# EAGLE design bdclock (EAGLE 7.5.0)
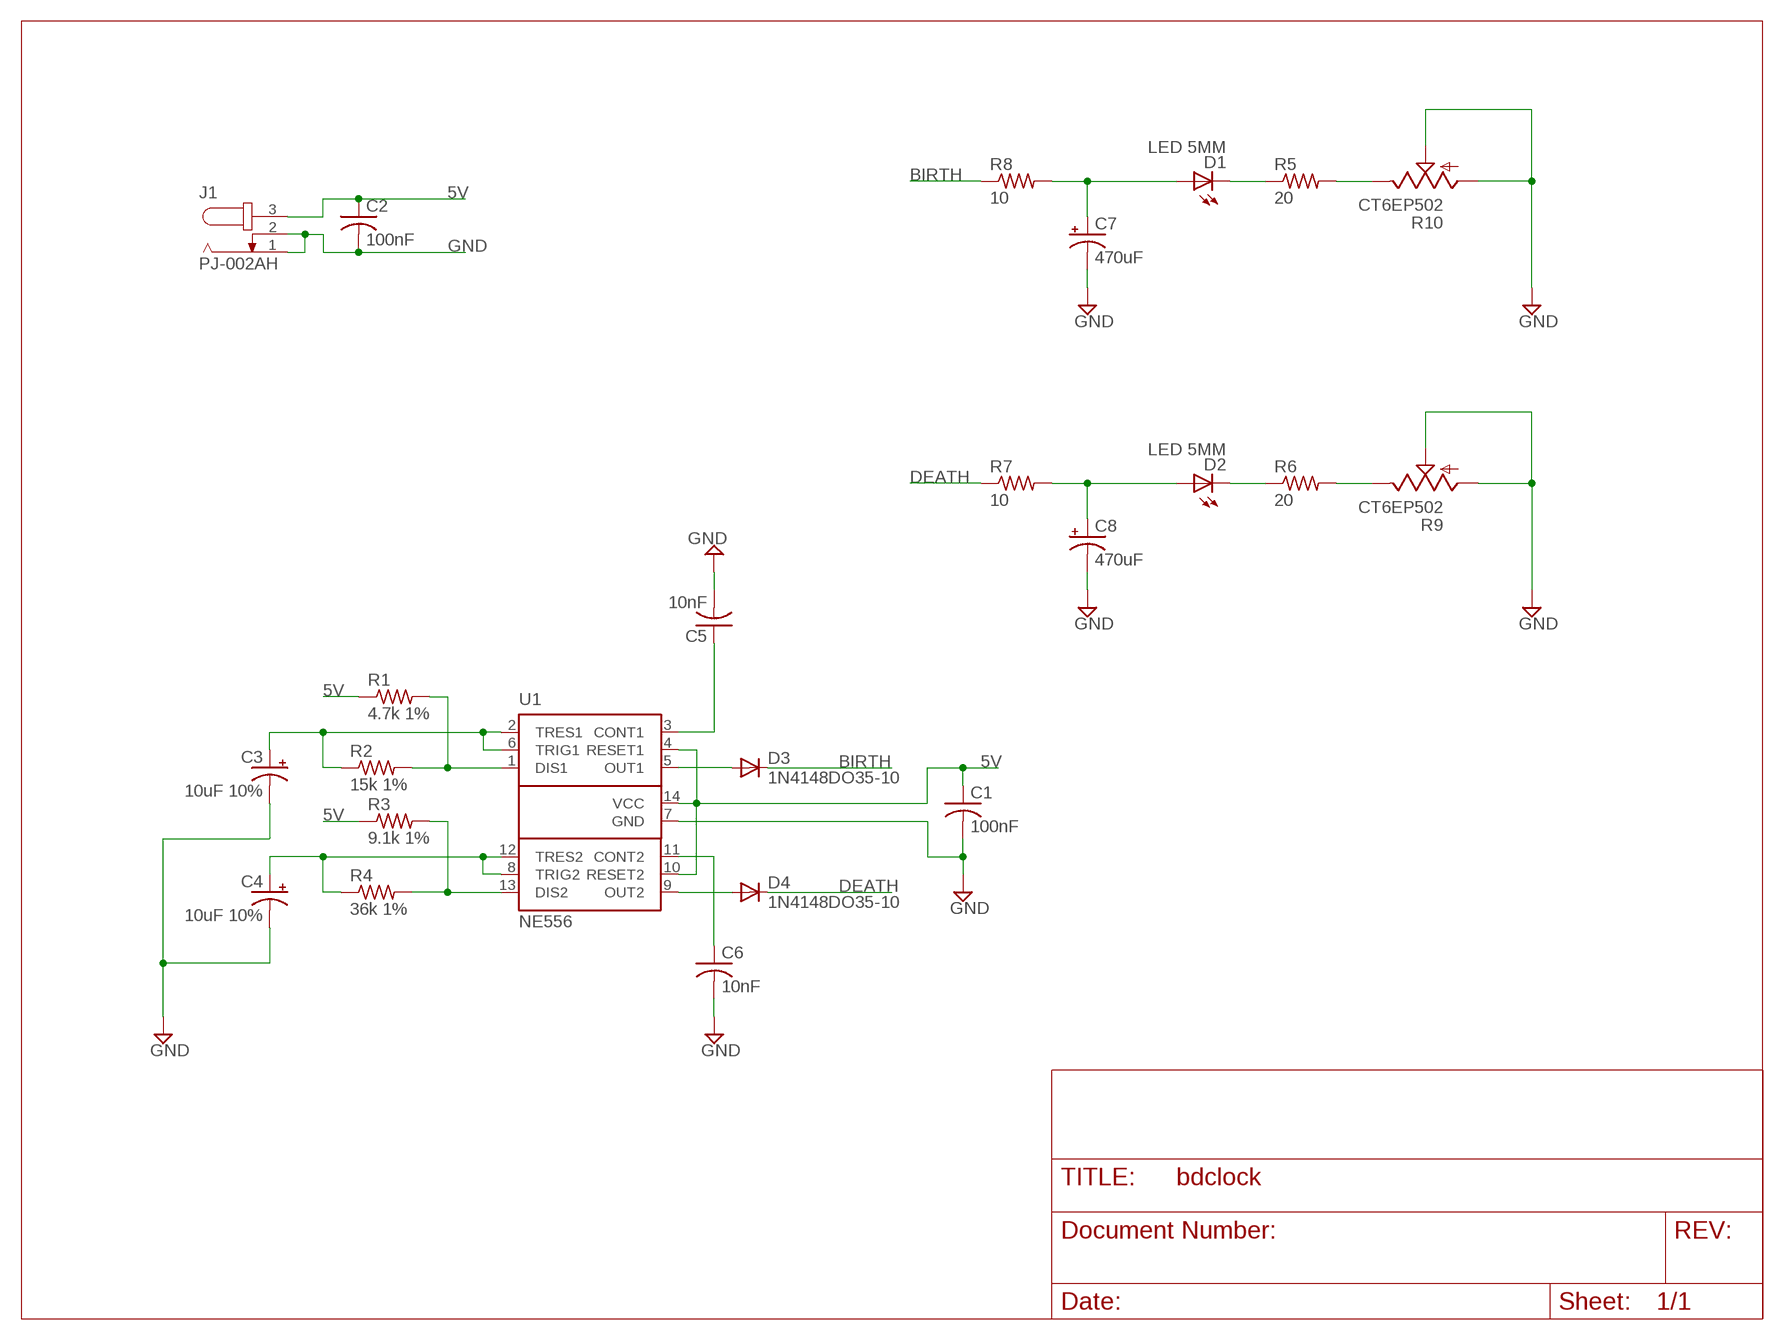
[diagram p0: schematic, sheet 1]

## Parts
C1  100nF  C-US025-025X050  [C025-025X050]
C2  100nF  C-US025-025X050  [C025-025X050]
C3  10uF 10%  CPOL-USE2-5  [E2-5]
C4  10uF 10%  CPOL-USE2-5  [E2-5]
C5  10nF  C-US025-024X044  [C025-024X044]
C6  10nF  C-US025-024X044  [C025-024X044]
C7  470uF  CPOL-USE2.5-6  [E2,5-6]
C8  470uF  CPOL-USE2.5-6  [E2,5-6]
D1  LED 5MM  LED5MM  [LED5MM]
D2  LED 5MM  LED5MM  [LED5MM]
D3  1N4148DO35-10  [DO35-10]
D4  1N4148DO35-10  [DO35-10]
J1  PJ-002AH  JACK-PLUG0  [SPC4077]
R1  4.7k 1%  R-US_0207/10  [0207/10]
R2  15k 1%  R-US_0207/10  [0207/10]
R3  9.1k 1%  R-US_0207/10  [0207/10]
R4  36k 1%  R-US_0207/10  [0207/10]
R5  20  R-US_0207/10  [0207/10]
R6  20  R-US_0207/10  [0207/10]
R7  10  R-US_0207/10  [0207/10]
R8  10  R-US_0207/10  [0207/10]
R9  CT6EP502  TRIM_US-CT6  [CT6]
R10  CT6EP502  TRIM_US-CT6  [CT6]
U1  NE556  [DIL14]

## Nets
5V: C1.1 C2.1 J1.3 R1.1 R3.1 U1.4(RESET1) U1.10(RESET2) U1.14(VCC)
BIRTH: D3.C R8.1
DEATH: D4.C R7.1
GND: C1.2 C2.2 C3.- C4.- C5.2 C6.2 C7.- C8.- J1.1 J1.2 R9.A R9.S R10.A R10.S U1.7(GND)
N$1: C3.+ R2.1 U1.2(TRES1) U1.6(TRIG1)
N$2: D3.A U1.5(OUT1)
N$3: C7.+ D1.A R8.2
N$4: C8.+ D2.A R7.2
N$5: R5.2 R10.E
N$6: R6.2 R9.E
N$7: D2.K(C) R6.1
N$8: D1.K(C) R5.1
N$9: D4.A U1.9(OUT2)
N$11: R1.2 R2.2 U1.1(DIS1)
N$12: C4.+ R4.1 U1.8(TRIG2) U1.12(TRES2)
N$15: C6.1 U1.11(CONT2)
N$16: C5.1 U1.3(CONT1)
N$17: R3.2 R4.2 U1.13(DIS2)

## Library data of the parts
C1 C2 C5 C6 = rcl:C-US: CAPACITOR, American symbol
C3 C4 C7 C8 = rcl:CPOL-US: POLARIZED CAPACITOR, American symbol
D1 D2 = led:LED: LED OSRAM: - CHIPLED LG R971, LG N971, LY N971, LG Q971, LY Q971, LO R971, LY R971 LH N974, LH R974 LS Q976, LO Q976, LY Q976 LO Q996 - Hyper CHIPLED LW Q18S LB Q993, LB Q99A, LB R99A - SideLED LS A670, LO A670, LY A670, LG A670, LP A670 LB A673, LV A673, LT A673, LW A673 LH A674 LY A675 LS A676, LA A676, LO A676, LY A676, LW A676 LS A679, LY A679, LG A679 - Hyper Micro SIDELED® LS Y876, LA Y876, LO Y876, LY Y876 LT Y87S - SmartLED LW L88C, LW L88S LB L89C, LB L89S, LG L890 LS L89K, LO L89K, LY L89K LS L896, LA L896, LO L896, LY L896 - TOPLED LS T670, LO T670, LY T670, LG T670, LP T670 LSG T670, LSP T670, LSY T670, LOP T670, LYG T670 LG T671, LOG T671, LSG T671 LB T673, LV T673, LT T673, LW T673 LH T674 LS T676, LA T676, LO T676, LY T676, LB T676, LH T676, LSB T676, LW T676 LB T67C, LV T67C, LT T67C, LS T67K, LO T67K, LY T67K, LW E67C LS E67B, LA E67B, LO E67B, LY E67B, LB E67C, LV E67C, LT E67C LW T67C LS T679, LY T679, LG T679 LS T770, LO T770, LY T770, LG T770, LP T770 LB T773, LV T773, LT T773, LW T773 LH T774 LS E675, LA E675, LY E675, LS T675 LS T776, LA T776, LO T776, LY T776, LB T776 LHGB T686 LT T68C, LB T68C - Hyper Mini TOPLED® LB M676 - Mini TOPLED Santana® LG M470 LS M47K, LO M47K, LY M47K Source: http://www.osram.convergy.de LUXEON: - LUMILED® LXK2-PW12-R00, LXK2-PW12-S00, LXK2-PW14-U00, LXK2-PW14-V00 LXK2-PM12-R00, LXK2-PM12-S00, LXK2-PM14-U00 LXK2-PE12-Q00, LXK2-PE12-R00, LXK2-PE12-S00, LXK2-PE14-T00, LXK2-PE14-U00 LXK2-PB12-K00, LXK2-PB12-L00, LXK2-PB12-M00, LXK2-PB14-N00, LXK2-PB14-P00, LXK2-PB14-Q00 LXK2-PR12-L00, LXK2-PR12-M00, LXK2-PR14-Q00, LXK2-PR14-R00 LXK2-PD12-Q00, LXK2-PD12-R00, LXK2-PD12-S00 LXK2-PH12-R00, LXK2-PH12-S00 LXK2-PL12-P00, LXK2-PL12-Q00, LXK2-PL12-R00 Source: www.luxeon.com KINGBRIGHT: KA-3528ASYC Source: www.kingbright.com
D3 D4 = diode:1N4148: DIODE high speed (Philips)
J1 = con-jack:JACK-PLUG: DC POWER JACK Power Jack, DC, Right Angle, Through Hole, Rated 5A at 16VDC, PC Terminals Distributor: Farnell (www.Farnell.de) Drawing: 84N1161.pdf / 84N1162.pdf Manufacturer: SPC Technology (www.spctechnology.com) Type: SPC4077 / SPC 4078; OC_FARNELL: unknown; OC_NEWARK: unknown
R1-R8 = rcl:R-US_: RESISTOR, American symbol
R9 R10 = pot:TRIM_US-: POTENTIOMETER
U1 = st-microelectronics:NE556: General Purpose Biopolartimer; MPN: NE556; OC_FARNELL: 2349784; OC_NEWARK: 83C0108

## Board
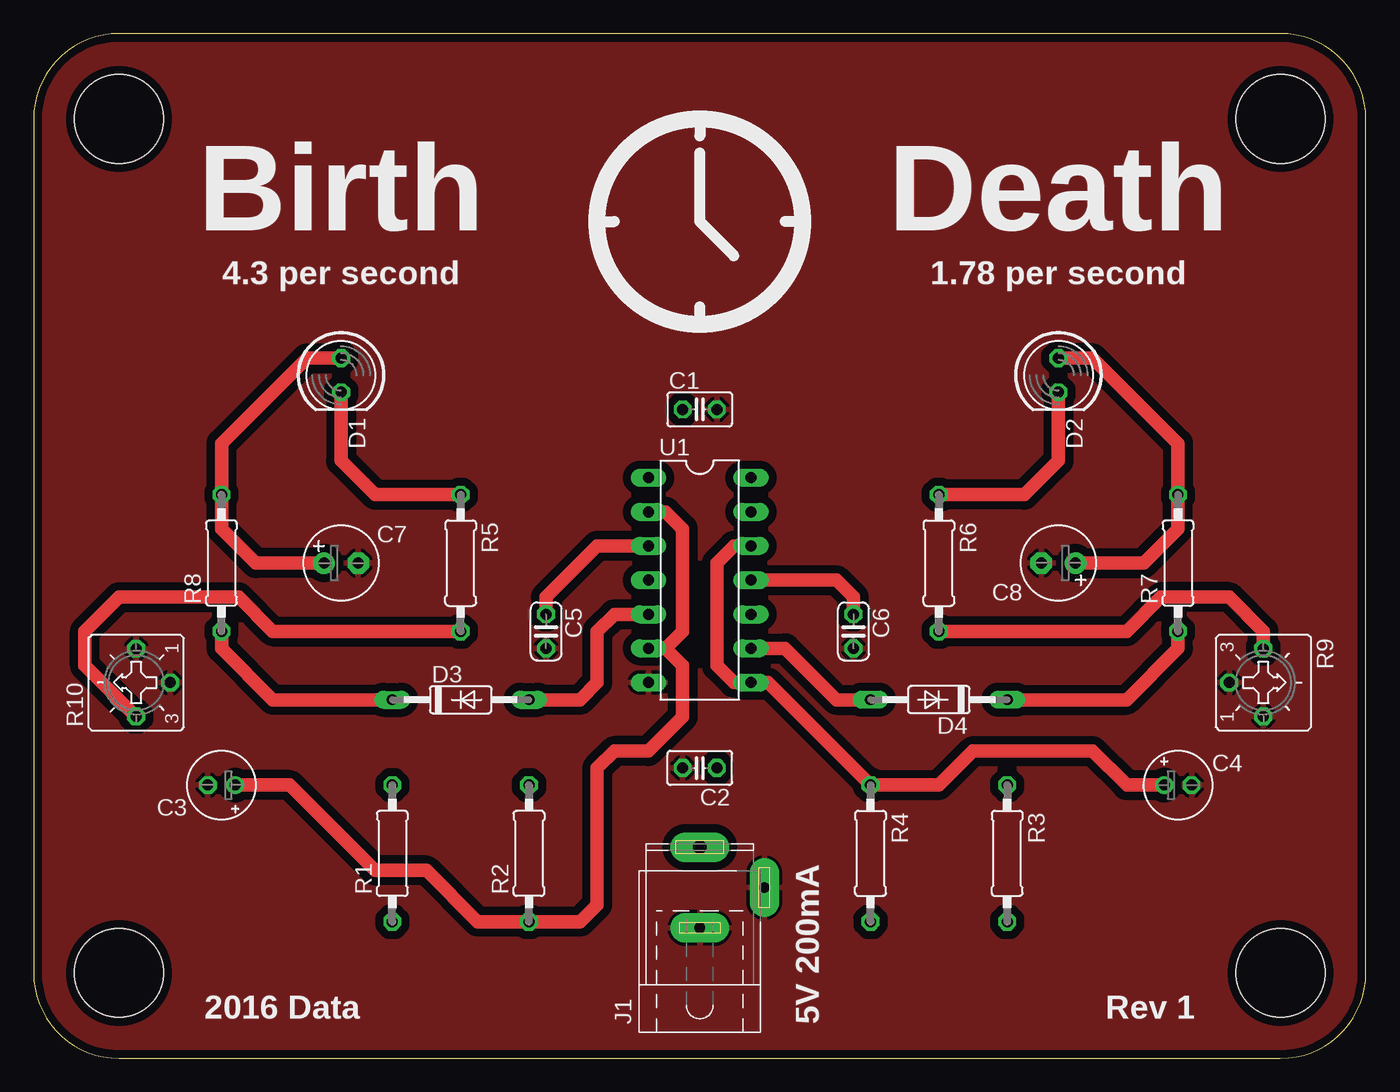
[diagram p1: board, top side]
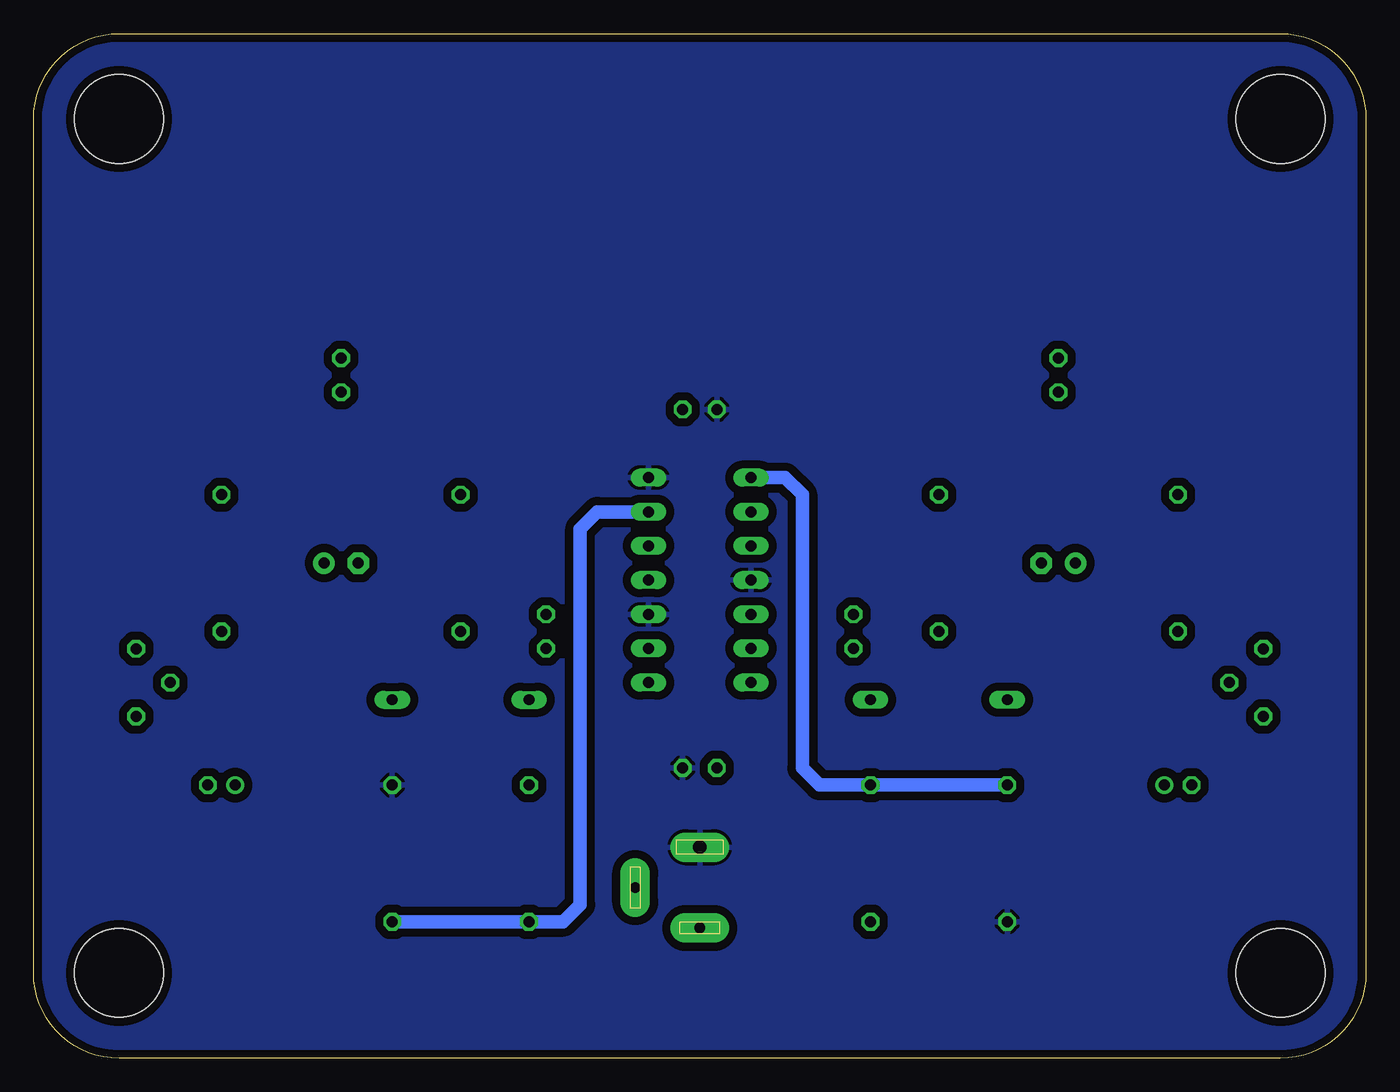
[diagram p2: board, bottom side, seen from below]

Size 99.06 x 76.2 mm. Coordinates in mm from the lower left corner, seen from the top.
Outline: 92.71,76.2 6.35,76.2 arc90 0,69.85 0,6.35 arc90 6.35,0 92.71,0 arc90 99.06,6.35 99.06,69.85 arc90 92.71,76.2
Copper layers (1*16): Top 0.035mm / dielectric 1.5mm / Bottom 0.035mm
Design rules "dirt_cheap_dirty_boards.v1": minimum track width 5mil, minimum drill 12mil, track to track 5mil, track to pad 5mil, pad to pad 5mil, via to via 5mil, smd to smd 0mil, copper to edge 10mil, drill to drill 10mil, minimum pad ring 10mil, minimum via ring 6mil, stop-mask expansion 2mil, vias tented up to drill 25mil, thermal gap 10mil
Holes 6.6 mm at 92.71,69.85 92.71,6.35 6.35,6.35 6.35,69.85

### Footprints (pad centres in the part's own frame; a part is rotated, then mirrored left to right if it is on the bottom)
C025-025X050 = drill 0.813 octagon: 1 -1.27,0; 2 1.27,0
E2-5 = drill 0.813 pad 1.27: + -1.016,0 | drill 0.813 pad 1.27 octagon: - 1.016,0
C025-024X044 = drill 0.813 octagon: 1 -1.27,0; 2 1.27,0
E2,5-6 = drill 0.813 pad 1.6: + -1.27,0 | drill 0.813 pad 1.6 octagon: - 1.27,0
LED5MM = drill 0.813 octagon: A -1.27,0; K 1.27,0
DO35-10 = drill 0.813 long: A 5.08,0; C -5.08,0
SPC4077 = drill 0.8 pad 2.184 long: 1 -3,0; 2 0,-4.8 | drill 1 pad 2.184 long: 3 3,0
0207/10 = drill 0.813 octagon: 1 -5.08,0; 2 5.08,0
CT6 = drill 0.813 octagon: A 2.515,0; E -2.515,0; S 0,-2.54
DIL14 = drill 0.813 long: 1 -7.62,-3.81; 2 -5.08,-3.81; 3 -2.54,-3.81; 4 0,-3.81; 5 2.54,-3.81; 6 5.08,-3.81; 7 7.62,-3.81; 8 7.62,3.81; 9 5.08,3.81; 10 2.54,3.81; 11 0,3.81; 12 -2.54,3.81; 13 -5.08,3.81; 14 -7.62,3.81

### Placement (x,y rotation side)
C1  49.53,48.26 0 top
C2  49.53,21.59 180 top
C3  13.97,20.32 180 top
C4  85.09,20.32 0 top
C5  38.1,31.75 270 top
C6  60.96,31.75 270 top
C7  22.86,36.83 0 top
C8  76.2,36.83 180 top
D1  22.86,50.8 270 top
D2  76.2,50.8 270 top
D3  31.75,26.67 0 top
D4  67.31,26.67 180 top
J1  49.53,12.7 90 top
R1  26.67,15.24 90 top
R2  36.83,15.24 90 top
R3  72.39,15.24 270 top
R4  62.23,15.24 270 top
R5  31.75,36.83 270 top
R6  67.31,36.83 270 top
R7  85.09,36.83 90 top
R8  13.97,36.83 90 top
R9  91.44,27.94 270 top
R10  7.62,27.94 90 top
U1  49.53,35.56 270 top

### Tracks (layer width: path | path; a pad name or v marks a point on that pad's centre or on a via)
5V
  pour Bottom (isolate 0.61): 0,76.2 0,0 99.06,0 99.06,76.2
BIRTH
  Top 1.016: D3.C 17.78,26.67 13.97,30.48 R8.1
DEATH
  Top 1.016: D4.C 81.28,26.67 85.09,30.48 R7.1
GND
  pour Top (isolate 0.61): 0,76.2 0,0 99.06,0 99.06,76.2
N$1
  Top 1.016: U1.2 46.99,40.64 48.26,39.37 48.26,31.75 46.99,30.48 | U1.6 46.99,30.48 | 46.99,30.48 48.26,29.21 48.26,25.4 45.72,22.86 43.18,22.86 41.91,21.59 41.91,11.43 40.64,10.16 R2.1 33.02,10.16 29.21,13.97 25.4,13.97 19.05,20.32 C3.+
N$2
  Top 1.016: U1.5 43.18,33.02 41.91,31.75 41.91,27.94 40.64,26.67 D3.A
N$3
  Top 1.016: C7.+ 16.51,36.83 13.97,39.37 R8.2 13.97,45.72 20.32,52.07 D1.A
N$4
  Top 1.016: C8.+ 82.55,36.83 85.09,39.37 R7.2 85.09,45.72 78.74,52.07 D2.A
N$5
  Top 1.016: R10.E 7.59,25.43 3.81,29.21 3.81,31.75 6.35,34.29 15.24,34.29 17.78,31.75 R5.2
N$6
  Top 1.016: R9.E 91.44,31.75 88.9,34.29 83.82,34.29 81.28,31.75 R6.2
N$7
  Top 1.016: D2.K 76.2,44.45 73.66,41.91 R6.1
N$8
  Top 1.016: D1.K 22.86,44.45 25.4,41.91 R5.1
N$9
  Top 1.016: U1.9 55.88,30.48 59.69,26.67 D4.A
N$11
  Bottom 1.016: U1.1 43.18,43.18 41.91,41.91 41.91,21.59 40.64,20.32 R2.2 R1.2
N$12
  Top 1.016: U1.12 52.07,38.1 50.8,36.83 50.8,29.21 52.07,27.94 U1.8 54.61,27.94 R4.1 67.31,20.32 69.85,22.86 78.74,22.86 81.28,20.32 C4.+
N$15
  Top 1.016: U1.11 59.69,35.56 60.96,34.29 C6.1
N$16
  Top 1.016: U1.3 41.91,38.1 38.1,34.29 C5.1
N$17
  Bottom 1.016: U1.13 57.15,40.64 58.42,39.37 58.42,11.43 59.69,10.16 R4.2 R3.2

### Text on the board
tPlace: Birth | Death | 4.3 per second | 1.78 per second | 2016 Data | Rev 1 | 5V 200mA